# EAGLE design SwitchRegTestBoard (EAGLE 6.4)
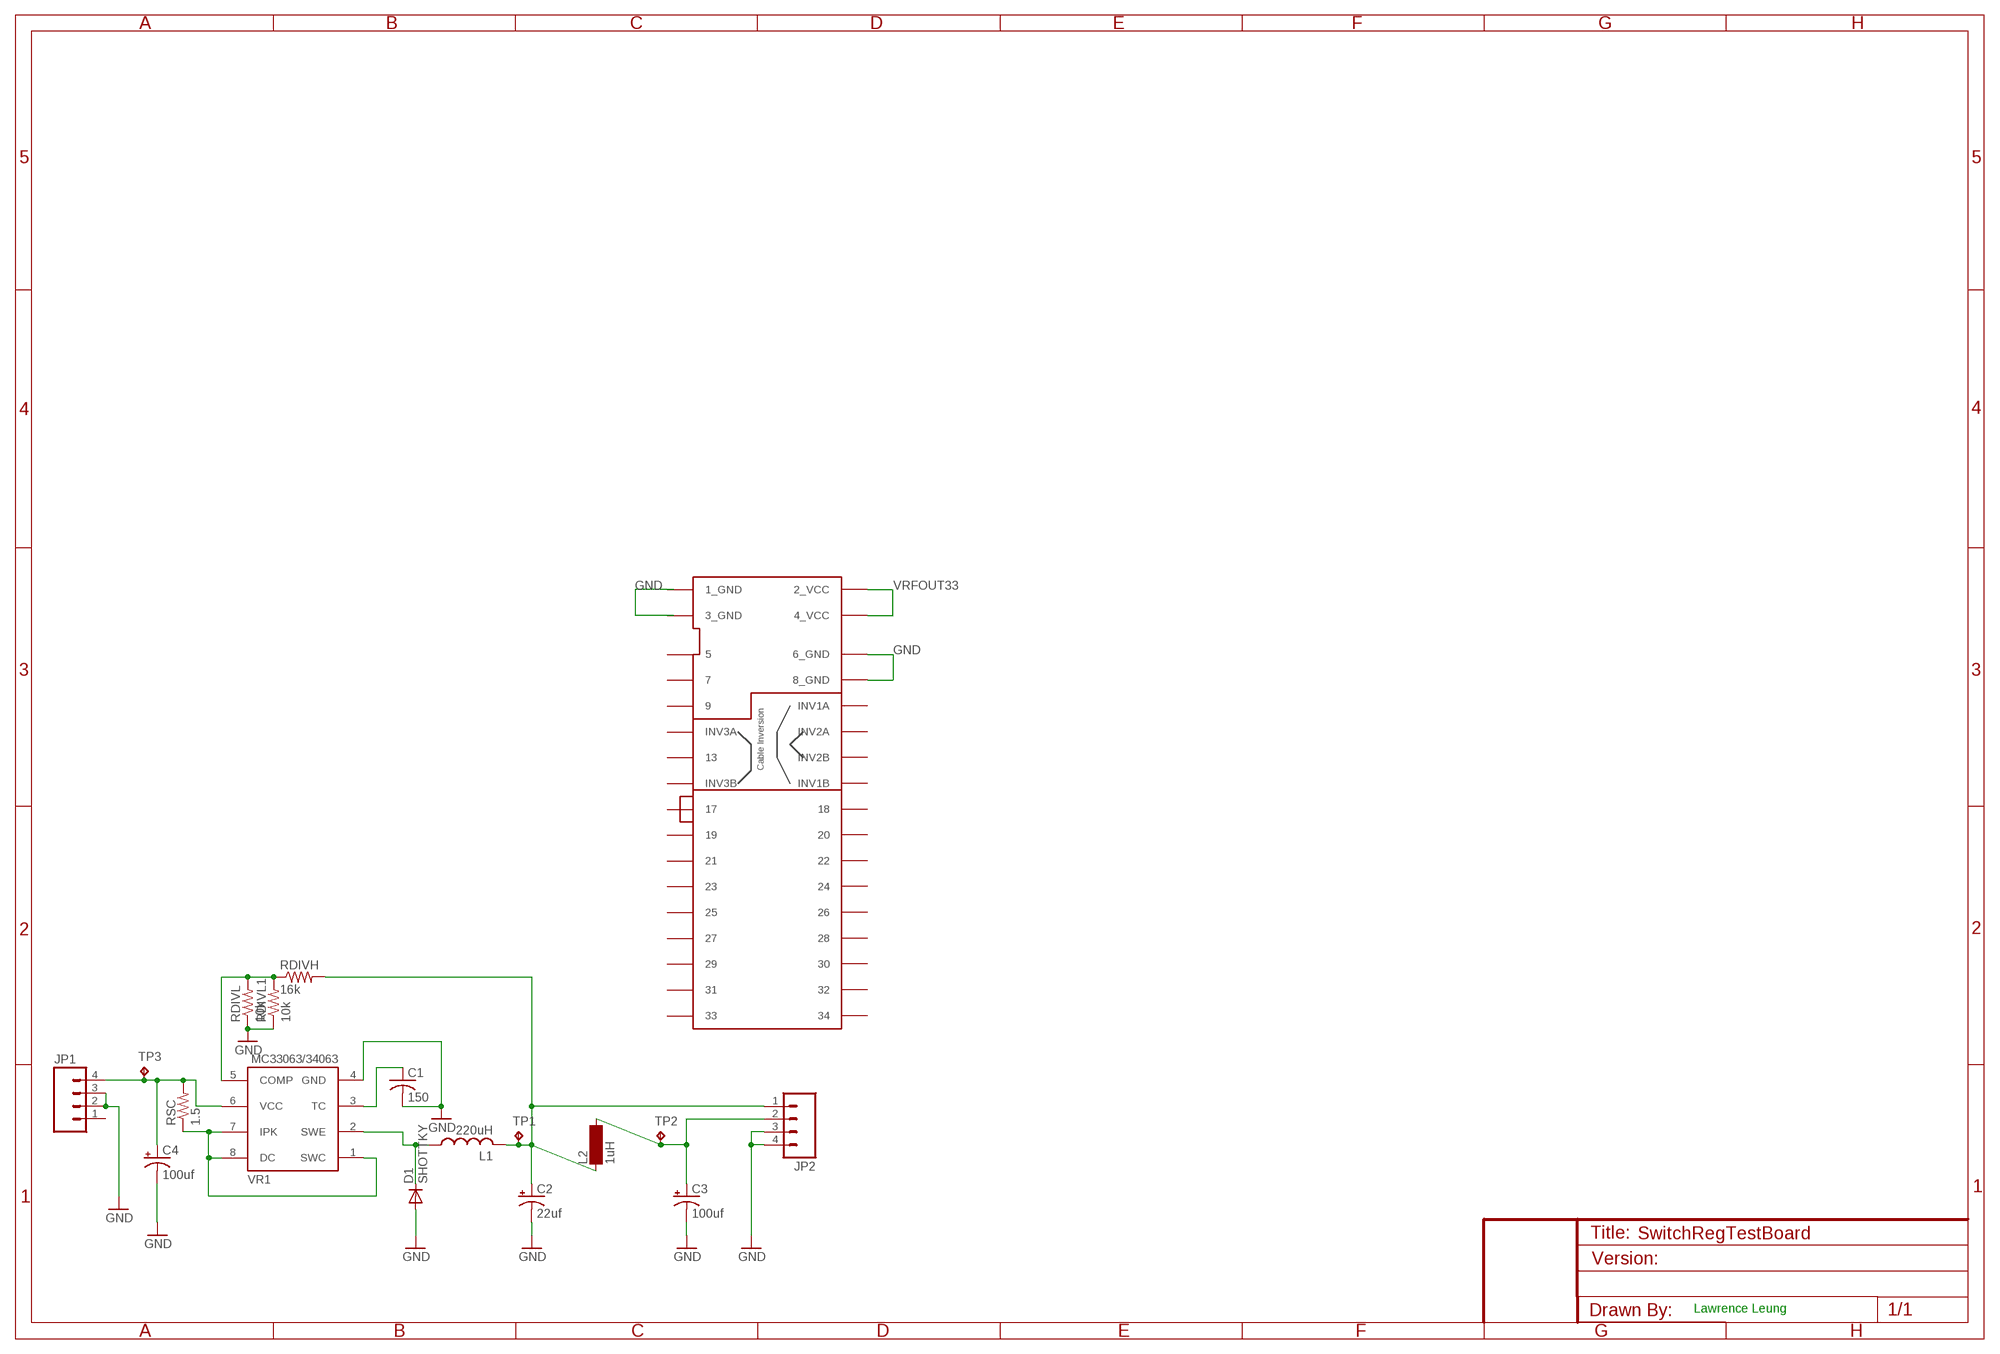
[diagram p0: schematic, sheet 1]

## Parts
C1  150  C-USC0603  [C0603]
C2  22uf  CPOL-USC  [PANASONIC_C]
C3  100uf  CPOL-USC  [PANASONIC_C]
C4  100uf  CPOL-USC  [PANASONIC_C]
D1  SHOTTKY  DIODE-SOD-123  [SOD-123]
JP1  HEADER1X4SMD_LONGPADS  [1X04-SMD-LONG]
JP2  HEADER1X4SMD_LONGPADS  [1X04-SMD-LONG]
L1  220uH  L-USL0707MM  [L0707MM]
L2  1uH  SM-NE29  [SM-NE29]
RDIVH  16k  R-US_R0805  [R0805]
RDIVL  10k  R-US_R0805  [R0805]
RDIVL1  10k  R-US_R0805  [R0805]
RSC  1.5  R-US_R1206  [R1206]
TP1  TPTP10R  [TP10R]
TP2  TPTP10R  [TP10R]
TP3  TPTP10R  [TP10R]
U$1  HEADER-525IDEB  [HEADER-525IDEB]
VR1  MC34063AD  MC33063/MC34063D  [SO08]

## Nets
DIVIDERCENTER: RDIVH.1 RDIVL1.2 RDIVL.2 VR1.5(COMP)
GND: C1.2 C2.- C3.- C4.- D1.A JP1.2 JP1.3 JP2.3 JP2.4 RDIVL1.1 RDIVL.1 U$1.6_INUSE(6_GND) U$1.8_INDEX(8_GND) VR1.4(GND)
N$2: RSC.1 VR1.1(SWC) VR1.7(IPK) VR1.8(DC)
N$3: C1.1 VR1.3(TC)
VIN: C4.+ JP1.4 RSC.2 TP3.TP VR1.6(VCC)
VR1L: D1.C L1.1 VR1.2(SWE)
VRFOUT33: C3.+ JP2.2 L2.2 TP2.TP U$1.2_DCD(2_VCC) U$1.4_DS3(4_VCC)
VROUT33: C2.+ JP2.1 L1.2 L2.1 RDIVH.2 TP1.TP
Unconnected: JP1.1 U$1.5_GND U$1.7_NC U$1.9_GND U$1.10_DS0_MEA_MEB(INV1A) U$1.11_GND(INV3A) U$1.12_DS1_DSB_DSA(INV2A) U$1.13_NC U$1.14_DS2_DSA_DSB(INV2B) U$1.15_GND(INV3B) U$1.16_MTRON_MEB_MEA(INV1B) U$1.17_MSEN1 U$1.18_DIR U$1.19_GND U$1.20_STEP U$1.21_FD_WR_DAT_L U$1.22_WDATE U$1.23_GND U$1.24_WGATE U$1.25_GND U$1.26_TRK0 U$1.27_MSEN0 U$1.28_WPT U$1.29_GND U$1.30_RDATA U$1.31_GND U$1.32SIDE1 U$1.33_GND U$1.34_RDY

## Notes on the sheet
- Lawrence Leung

## Power pins joined to a net without a drawn wire
1_GND: U$1.1_GND
3_GND: U$1.3_KEY_NC(3_GND)

## Library data of the parts
C1 = LL:C-US: CAPACITOR, American symbol
C2-C4 = LL:CPOL-US: POLARIZED CAPACITOR, American symbol Footprints somewhat modified from Adafruits (1206)
D1 = dp_devices:DIODE: Various Diode Packages
JP1 JP2 = LL:HEADER1X4: Header 4 Standard 4-pin 0.1" header. Modified from sparkfun for etch footprints
L1 = LL:L-US: INDUCTOR, American symbol
L2 = inductor-neosid:SM-NE29: INDUCTOR SMD chip inductor; OC_FARNELL: unknown; OC_NEWARK: unknown
RDIVH RDIVL RDIVL1 RSC = LL:R-US_: RESISTOR, American symbol
TP1-TP3 = testpad:TP: Test pad
U$1 = LL:HEADER-525IDEB: PATA Floppy drive Edge connector
VR1 = adafruit:MC33063/MC34063: MC33063 and MC34063 Basic DC/DC converter with internal power-NPN transistor, 100KHz, 1.5A peak switch current. 3-40 input/output.

## Board
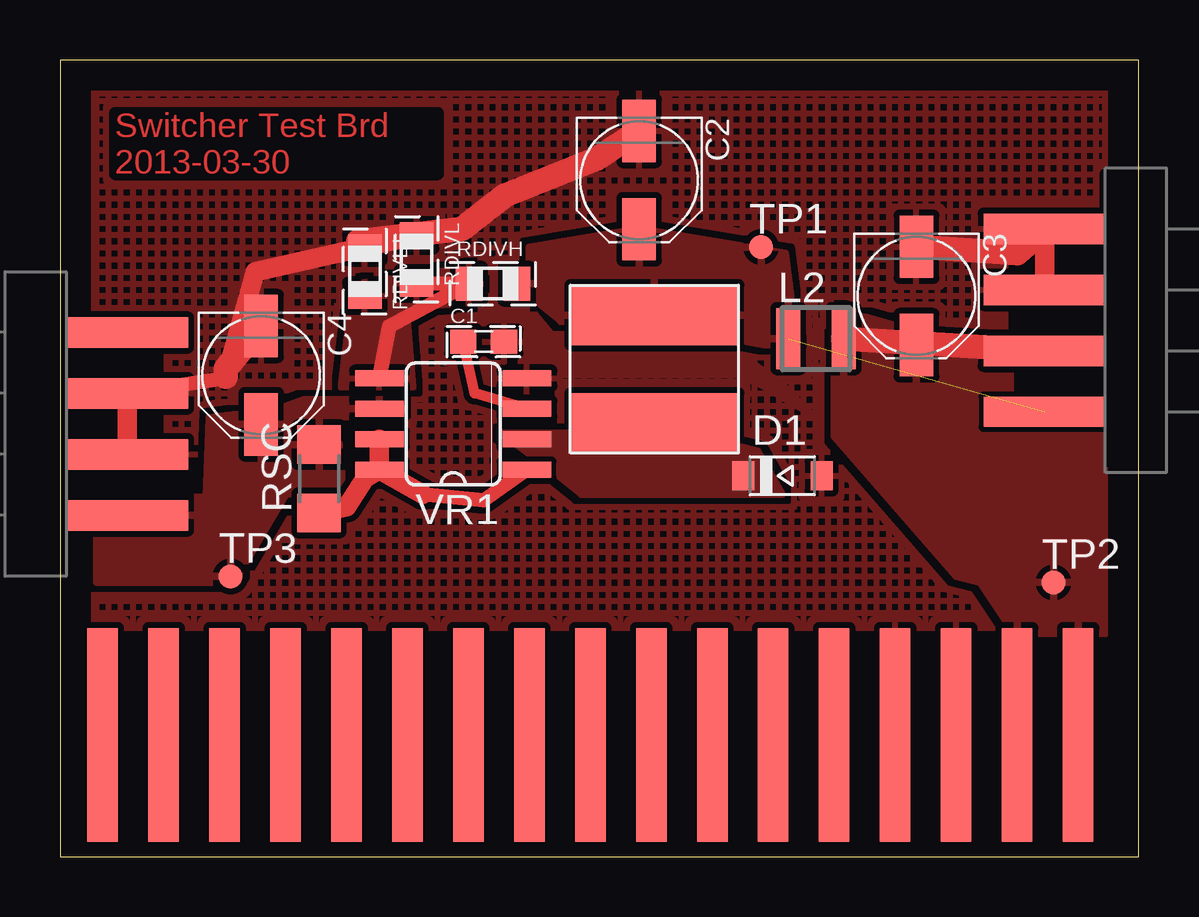
[diagram p1: board, top side]
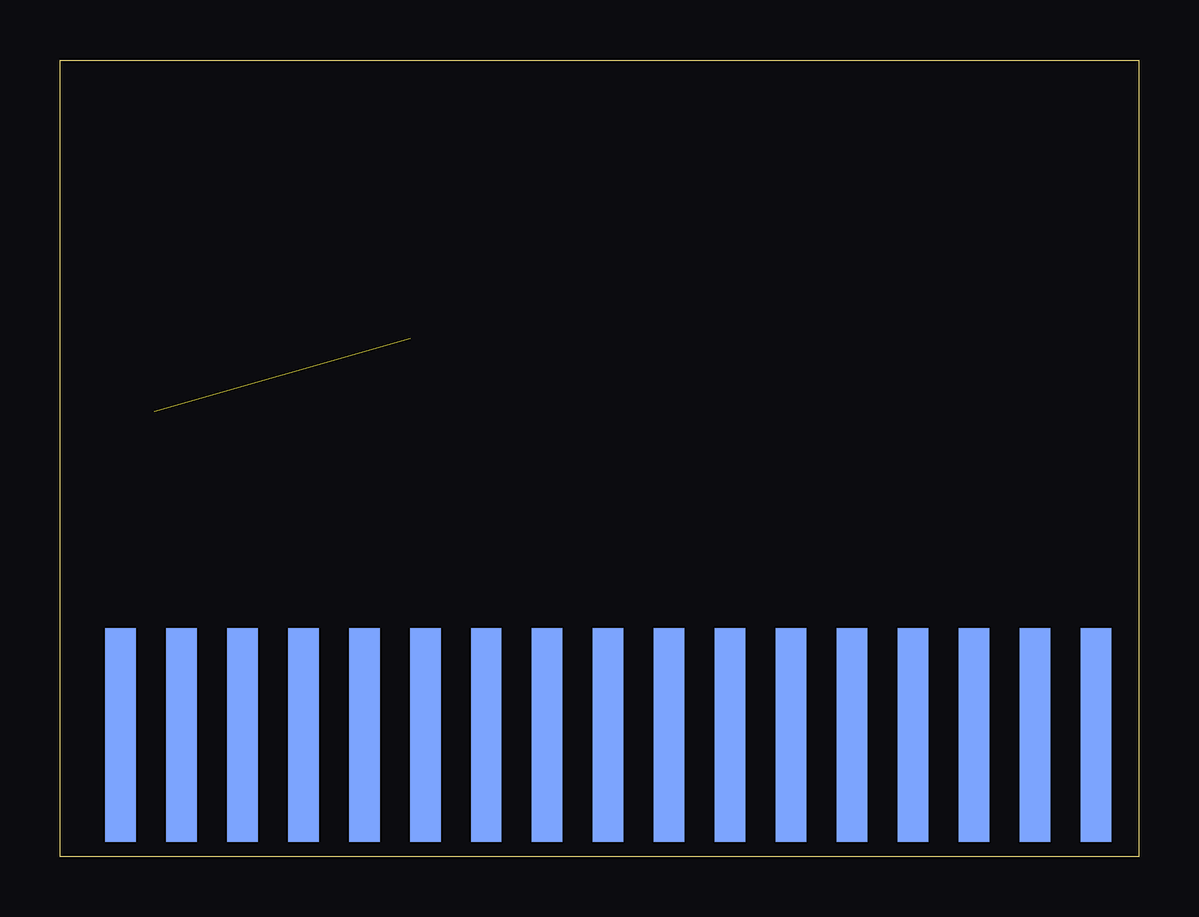
[diagram p2: board, bottom side, seen from below]

Size 44.94 x 33.2 mm. Coordinates in mm from the lower left corner, seen from the top.
Outline: 0,0 44.94,0 44.94,33.2 0,33.2 0,0
Copper layers (1*16): Top 0.0356mm / dielectric 1.5011mm / Bottom 0.0356mm
Design rules "ll-etch": minimum track width 12mil, minimum drill 21mil, track to track 8mil, track to pad 12mil, pad to pad 18mil, via to via 20mil, smd to smd 4mil, copper to edge 50mil, drill to drill 30mil, minimum pad ring 20mil, minimum via ring 18mil, stop-mask expansion 6mil, vias tented up to drill 20mil, thermal gap 10mil

### Footprints (pad centres in the part's own frame; a part is rotated, then mirrored left to right if it is on the bottom)
C0603 = smd 1.1 x 1: 1 -0.85,0; 2 0.85,0
PANASONIC_C = smd 2.6 x 1.4: + 2.05,0; - -2.05,0
SOD-123 = smd 0.91 x 1.22: A 1.635,0; C -1.635,0
1X04-SMD-LONG = smd 1.27 x 5.08: 1 -3.81,0; 2 -1.27,0; 3 1.27,0; 4 3.81,0
L0707MM = smd 7 x 2.5: 1 0,2.25; 2 0,-2.25
SM-NE29 = smd 1 x 2.54: 1 -1.15,0; 2 1.15,0
R0805 = smd 1.1 x 1.4: 1 -1,0; 2 1,0
R1206 = smd 1.6 x 1.803: 1 -1.422,0; 2 1.422,0
TP10R = smd 1 x 1: TP 0,0
HEADER-525IDEB = smd 1.27 x 8.89 bottom: 1_GND 21.59,0; 3_KEY_NC 19.05,0; 5_GND 16.51,0; 7_NC 13.97,0; 9_GND 11.43,0; 11_GND 8.89,0; 13_NC 6.35,0; 15_GND 3.81,0; 17_MSEN1 1.27,0; 19_GND -1.27,0; 21_FD_WR_DAT_L -3.81,0; 23_GND -6.35,0; 25_GND -8.89,0; 27_MSEN0 -11.43,0; 29_GND -13.97,0; 31_GND -16.51,0; 33_GND -19.05,0 | smd 1.27 x 8.89: 2_DCD 21.59,0; 4_DS3 19.05,0; 6_INUSE 16.51,0; 8_INDEX 13.97,0; 10_DS0_MEA_MEB 11.43,0; 12_DS1_DSB_DSA 8.89,0; 14_DS2_DSA_DSB 6.35,0; 16_MTRON_MEB_MEA 3.81,0; 18_DIR 1.27,0; 20_STEP -1.27,0; 22_WDATE -3.81,0; 24_WGATE -6.35,0; 26_TRK0 -8.89,0; 28_WPT -11.43,0; 30_RDATA -13.97,0; 32SIDE1 -16.51,0; 34_RDY -19.05,0
SO08 = smd 0.66 x 2.032: 1 -1.905,-3.073; 2 -0.635,-3.073; 3 0.635,-3.073; 4 1.905,-3.073; 5 1.905,3.073; 6 0.635,3.073; 7 -0.635,3.073; 8 -1.905,3.073

### Placement (x,y rotation side)
C1  17.65,21.46 0 top
C2  24.13,28.19 270 top
C3  35.69,23.37 270 top
C4  8.38,20.07 270 top
D1  30.1,15.88 0 top
JP1  2.79,18.03 270 top
JP2  41.02,22.35 90 top
L1  24.77,20.32 180 top
L2  31.5,21.59 0 top
RDIVH  18.03,23.88 0 top
RDIVL  14.86,24.89 270 top
RDIVL1  12.7,24.38 270 top
RSC  10.79,15.75 90 top
TP1  29.21,25.4 0 top
TP2  41.4,11.43 0 top
TP3  7.11,11.68 0 top
U$1  20.83,5.08 0 top
VR1  16.38,18.03 90 top

### Tracks (layer width: path | path; a pad name or v marks a point on that pad's centre or on a via)
DIVIDERCENTER
  Top 0.61: VR1.5 13.72,22.1 RDIVH.1 RDIVL.2
  pour Top (isolate 0.254): 12.19,23.88 11.68,19.56 14.73,19.56 14.48,22.86 17.53,23.11 17.53,24.64
GND
  Top 0.61: JP1.2 6.86,19.94
  Top 0.813: JP1.3 JP1.2 | 6.86,19.94 6.91,20.01 8.13,24.38 RDIVL.1 | JP2.3 JP2.4
  Top 1.016: JP2.4 39.88,25.15 C3.- | RDIVL.1 12.43,25.64 16.76,26.16 18.54,27.56 22.37,29.08 C2.- | C4.- 6.91,20.34 6.91,20.01
  pour Top (isolate 0.254, rank 3, hatched): 0,33.02 0,-0.25 44.45,-0.25 44.45,33.02
  pour Top (isolate 0.254): 17.53,22.61 19.81,22.61 21.08,21.08 28.19,21.08 29.97,19.81 31.5,18.29 28.45,20.07 17.53,20.07
N$2
  Top 0.61: 15.11,15.11 17.65,14.86 VR1.1
  Top 0.813: RSC.1 11.94,14.58 12.7,15.75 VR1.8 | VR1.8 VR1.7 | VR1.8 15.11,15.11
N$3
  Top 0.406: VR1.3 17.27,19.3 C1.1
VIN
  pour Top (isolate 0.254): 1.52,14.99 6.1,14.99 6.22,18.29 9.14,18.67 10.16,19.05 14.22,19.05 14.22,18.54 12.7,18.54 11.56,18.03 11.81,15.24 9.4,15.11 7.24,11.43 1.52,11.43
VR1L
  pour Top (no thermals): 18.41,17.65 20.45,16.13 21.72,15.11 30.1,15.11 29.08,16.89 26.04,17.65
VRFOUT33
  Top 0.813: L2.2 C3.+
  Top 1.016: L2.2 JP2.2
  pour Top: 40.39,8.38 44.7,9.65 43.18,20.07 37.59,21.34 32.26,22.86 32.26,17.53 37.34,11.68 38.35,11.43
VROUT33  (1 unrouted)
  pour Top (isolate 0.254): 27.94,21.59 30.73,21.08 30.23,25.15 24.13,26.16 19.56,25.4 19.56,23.37 20.83,22.35 21.59,21.59

### Text on the board
Top: Switcher Test Brd / 2013-03-30